# EAGLE design breakout (EAGLE 9.6.2)
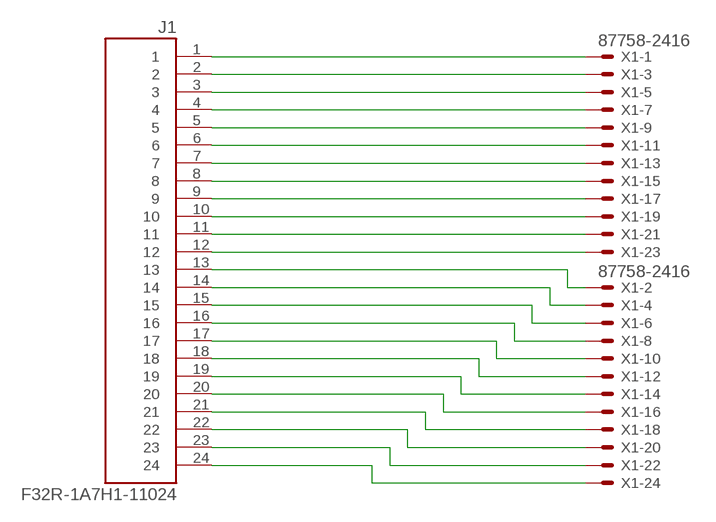
[diagram p0: schematic, sheet 1]

## Parts
J1  F32R-1A7H1-11024  [AMPHENOL_F32R-1A7H1-11024]
X1  87758-2416  [87758-2416]

## Nets
N$1: J1.1 X1.1
N$2: J1.2 X1.3
N$3: J1.3 X1.5
N$4: J1.4 X1.7
N$5: J1.5 X1.9
N$6: J1.6 X1.11
N$7: J1.7 X1.13
N$8: J1.8 X1.15
N$9: J1.9 X1.17
N$10: J1.10 X1.19
N$11: J1.11 X1.21
N$12: J1.12 X1.23
N$13: J1.13 X1.2
N$14: J1.14 X1.4
N$15: J1.15 X1.6
N$16: J1.16 X1.8
N$17: J1.17 X1.10
N$18: J1.18 X1.12
N$19: J1.19 X1.14
N$20: J1.20 X1.16
N$21: J1.21 X1.18
N$22: J1.22 X1.20
N$23: J1.23 X1.22
N$24: J1.24 X1.24

## Library data of the parts
J1 = F32R-1A7H1-11024:F32R-1A7H1-11024; MANUFACTURER: Amphenol; MAXIMUM_PACKAGE_HEIGHT: 2.5 mm; PARTREV: C; STANDARD: Manufacturer Recommendations
X1 = con-molex:87758-2416: 24 Pin - 2mm Dual Row Single Wafer, Vertical T/H HDR Source: http://www.molex.com/pdm_docs/sd/877580616_sd.pdf; MF: MOLEX; MPN: 87758-2416; OC_FARNELL: unknown; OC_NEWARK: 25M5679

## Board
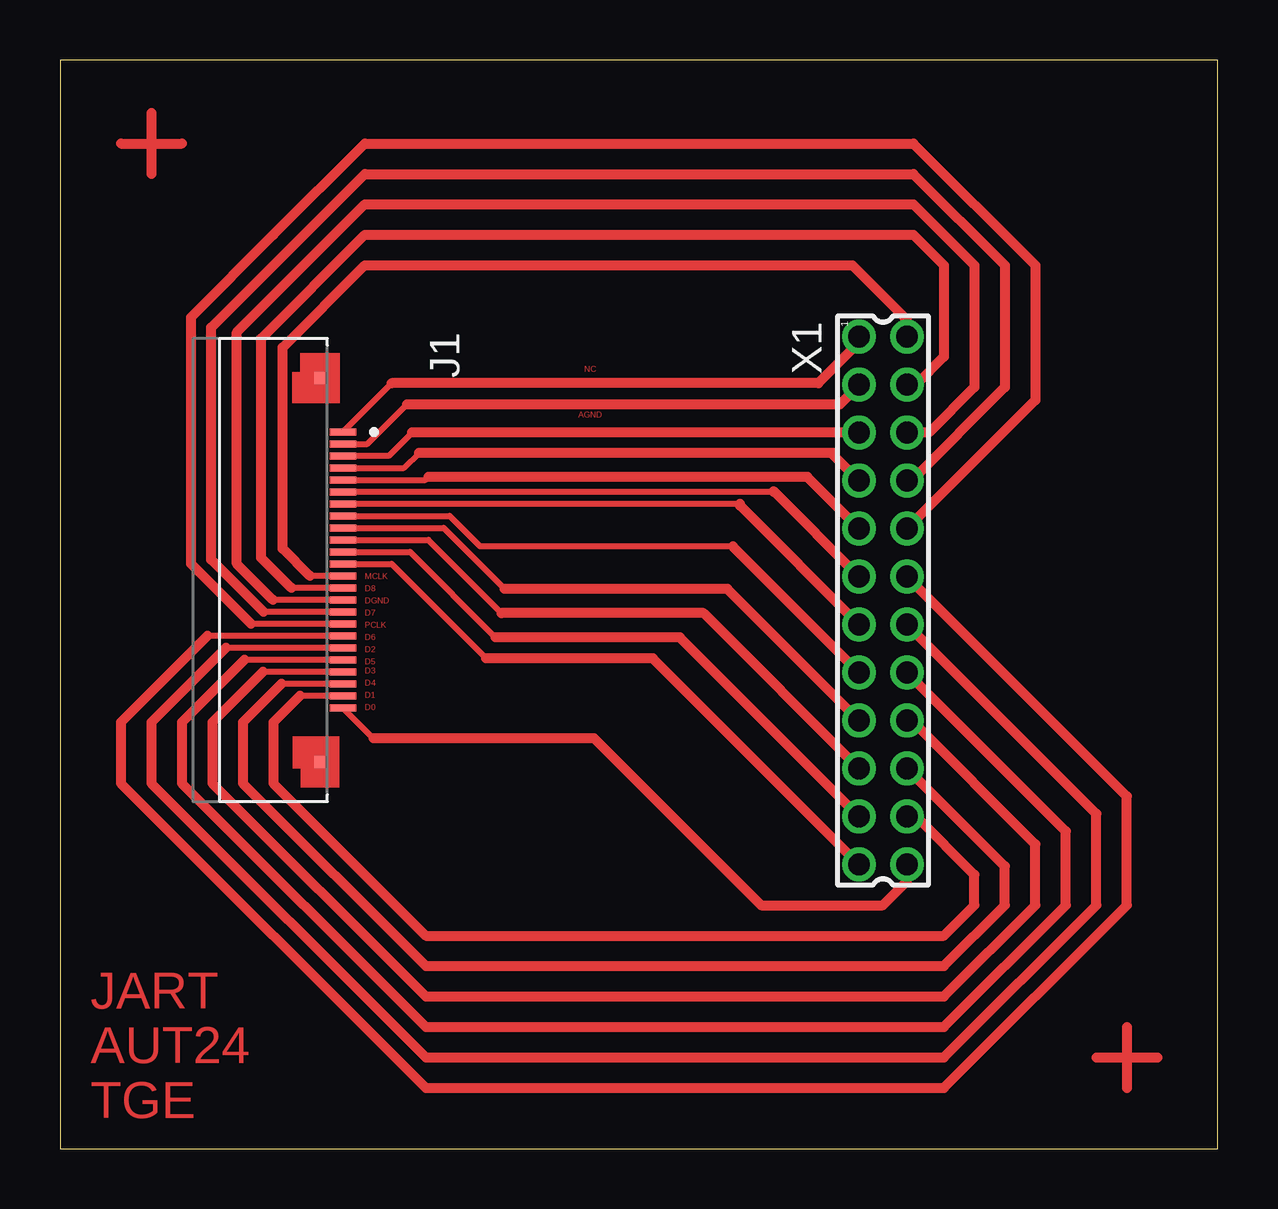
[diagram p1: board, top side]

Size 48.24 x 45.39 mm. Coordinates in mm from the lower left corner, seen from the top.
Outline: 0,0 48.24,0 48.24,45.39 0,45.39 0,0
Copper layers (1*16): Top 0.035mm / dielectric 1.5mm / Bottom 0.035mm
Design rules "default": minimum track width 6mil, minimum drill 0.35mm, track to track 6mil, track to pad 6mil, pad to pad 6mil, via to via 6mil, smd to smd 6mil, copper to edge 40mil, drill to drill 6mil, minimum pad ring 10mil, minimum via ring 8mil, stop-mask expansion 4mil, vias tented up to drill 0mil, thermal gap 10mil

### Footprints (pad centres in the part's own frame; a part is rotated, then mirrored left to right if it is on the bottom)
AMPHENOL_F32R-1A7H1-11024 = smd 0.3 x 1.1: 1 -5.75,2.9; 2 -5.25,2.9; 3 -4.75,2.9; 4 -4.25,2.9; 5 -3.75,2.9; 6 -3.25,2.9; 7 -2.75,2.9; 8 -2.25,2.9; 9 -1.75,2.9; 10 -1.25,2.9; 11 -0.75,2.9; 12 -0.25,2.9; 13 0.25,2.9; 14 0.75,2.9; 15 1.25,2.9; 16 1.75,2.9; 17 2.25,2.9; 18 2.75,2.9; 19 3.25,2.9; 20 3.75,2.9; 21 4.25,2.9; 22 4.75,2.9; 23 5.25,2.9; 24 5.75,2.9 | smd 0.5 x 0.5: S1 -8,1.95; S2 8,1.95
87758-2416 = drill 0.9 pad 1.27: 1 -11,-1; 2 -11,1; 3 -9,-1; 4 -9,1; 5 -7,-1; 6 -7,1; 7 -5,-1; 8 -5,1; 9 -3,-1; 10 -3,1; 11 -1,-1; 12 -1,1; 13 1,-1; 14 1,1; 15 3,-1; 16 3,1; 17 5,-1; 18 5,1; 19 7,-1; 20 7,1; 21 9,-1; 22 9,1; 23 11,-1; 24 11,1

### Placement (x,y rotation side)
J1  8.89,24.13 270 top
X1  34.29,22.86 270 top

### Tracks (layer width: path | path; a pad name or v marks a point on that pad's centre or on a via)
N$1
  Top 0.254: J1.1 13.82,31.91
  Top 0.406: 13.82,31.91 31.6,31.91 33.29,33.6 X1.1
N$2
  Top 0.254: 14.46,31.03 12.81,29.38 J1.2
  Top 0.406: X1.3 33.29,31.83 32.49,31.03 14.46,31.03
N$3
  Top 0.254: 14.68,29.86 13.7,28.88 J1.3
  Top 0.406: X1.5 14.68,29.86
N$4
  Top 0.254: 14.96,29.02 14.33,28.38 J1.4
  Top 0.406: X1.7 32.2,28.95 32.26,29.02 14.96,29.02
N$5
  Top 0.254: 15.35,28.01 15.22,27.88 J1.5
  Top 0.406: 15.35,28.01 31.14,28.01 X1.9
N$6
  Top 0.254: 29.73,27.38 J1.6
  Top 0.406: X1.11 29.73,27.42 29.73,27.38
N$7
  Top 0.254: 28.34,26.88 J1.7
  Top 0.406: 28.34,26.88 28.34,26.81 X1.13
N$8
  Top 0.254: 28.04,25.11 17.5,25.11 16.23,26.38 J1.8
  Top 0.406: 28.04,25.11 X1.15
N$9
  Top 0.254: 18.52,23.34 15.98,25.88 J1.9
  Top 0.406: 18.52,23.34 27.81,23.34 X1.17
N$10
  Top 0.254: 18.39,22.33 15.35,25.38 J1.10
  Top 0.406: 18.39,22.33 26.82,22.33 X1.19
N$11
  Top 0.254: J1.11 14.58,24.88 18.14,21.32
  Top 0.406: 18.14,21.32 25.83,21.32 X1.21
N$12
  Top 0.254: J1.12 13.82,24.38 17.76,20.44
  Top 0.406: 17.76,20.44 24.71,20.44 X1.23
N$13
  Top 0.254: J1.13 10.41,23.88
  Top 0.406: 10.41,23.88 9.27,25.02 9.27,33.4 12.7,36.83 33.02,36.83 35.29,34.56 X1.2
N$14
  Top 0.254: J1.14 9.64,23.38
  Top 0.406: 9.64,23.38 8.38,24.64 8.38,33.78 12.7,38.1 35.56,38.1 36.83,36.83 36.83,33.02 35.67,31.86 X1.4
N$15
  Top 0.254: J1.15 8.87,22.88
  Top 0.406: 8.87,22.88 7.37,24.38 7.37,34.04 12.7,39.37 35.56,39.37 38.1,36.83 38.1,31.75 36.21,29.86 X1.6
N$16
  Top 0.254: J1.16 8.48,22.38
  Top 0.406: X1.8 35.48,27.86 39.37,31.75 39.37,36.83 35.56,40.64 12.7,40.64 6.3,34.24 6.3,24.56 8.48,22.38
N$17
  Top 0.254: J1.17 7.96,21.88
  Top 0.406: 7.96,21.88 5.46,24.38 5.46,34.67 8.89,38.1 12.7,41.91 35.56,41.91 40.64,36.83 40.64,31.21 X1.10
N$18
  Top 0.254: J1.18 6.14,21.38
  Top 0.406: 6.14,21.38 2.54,17.78 2.54,15.24 15.24,2.54 36.83,2.54 44.45,10.16 44.45,14.7 X1.12
N$19
  Top 0.254: J1.19 6.91,20.88
  Top 0.406: X1.14 43.18,13.97 43.18,10.16 36.83,3.81 15.24,3.81 3.81,15.24 3.81,17.78 6.91,20.88
N$20
  Top 0.254: J1.20 7.68,20.38
  Top 0.406: X1.16 41.91,13.24 41.91,10.16 36.83,5.08 15.24,5.08 5.08,15.24 5.08,17.78 7.68,20.38
N$21
  Top 0.254: J1.21 8.45,19.88
  Top 0.406: X1.18 35.48,17.86 40.64,12.7 40.64,10.16 36.83,6.35 15.24,6.35 6.35,15.24 6.35,17.78 8.45,19.88
N$22
  Top 0.254: J1.22 9.22,19.38
  Top 0.406: 9.22,19.38 7.62,17.78 7.62,15.24 15.24,7.62 36.83,7.62 39.37,10.16 39.37,11.78 X1.20
N$23
  Top 0.254: J1.23 9.99,18.88
  Top 0.406: 9.99,18.88 8.89,17.78 8.89,15.24 15.24,8.89 36.83,8.89 38.1,10.16 38.1,11.43 35.67,13.86 X1.22
N$24
  Top 0.254: J1.24 13.06,17.11
  Top 0.406: 13.06,17.11 22.26,17.11 29.21,10.16 34.29,10.16 35.29,11.16 X1.24
N$25
  Top 0.406: 3.81,43.18 3.81,40.64
N$27
  Top 0.406: 2.54,41.91 5.08,41.91
N$29
  Top 0.406: 44.45,5.08 44.45,2.54
N$30
  Top 0.406: 43.18,3.81 45.72,3.81

### Text on the board
Top: NC | AGND | MCLK | D8 | DGND | D7 | PCLK | D2 | D6 | D3 | D5 | D1 | D4 | D0 | JART / AUT24 / TGE